# EAGLE design Rfid (EAGLE 7.6.0)
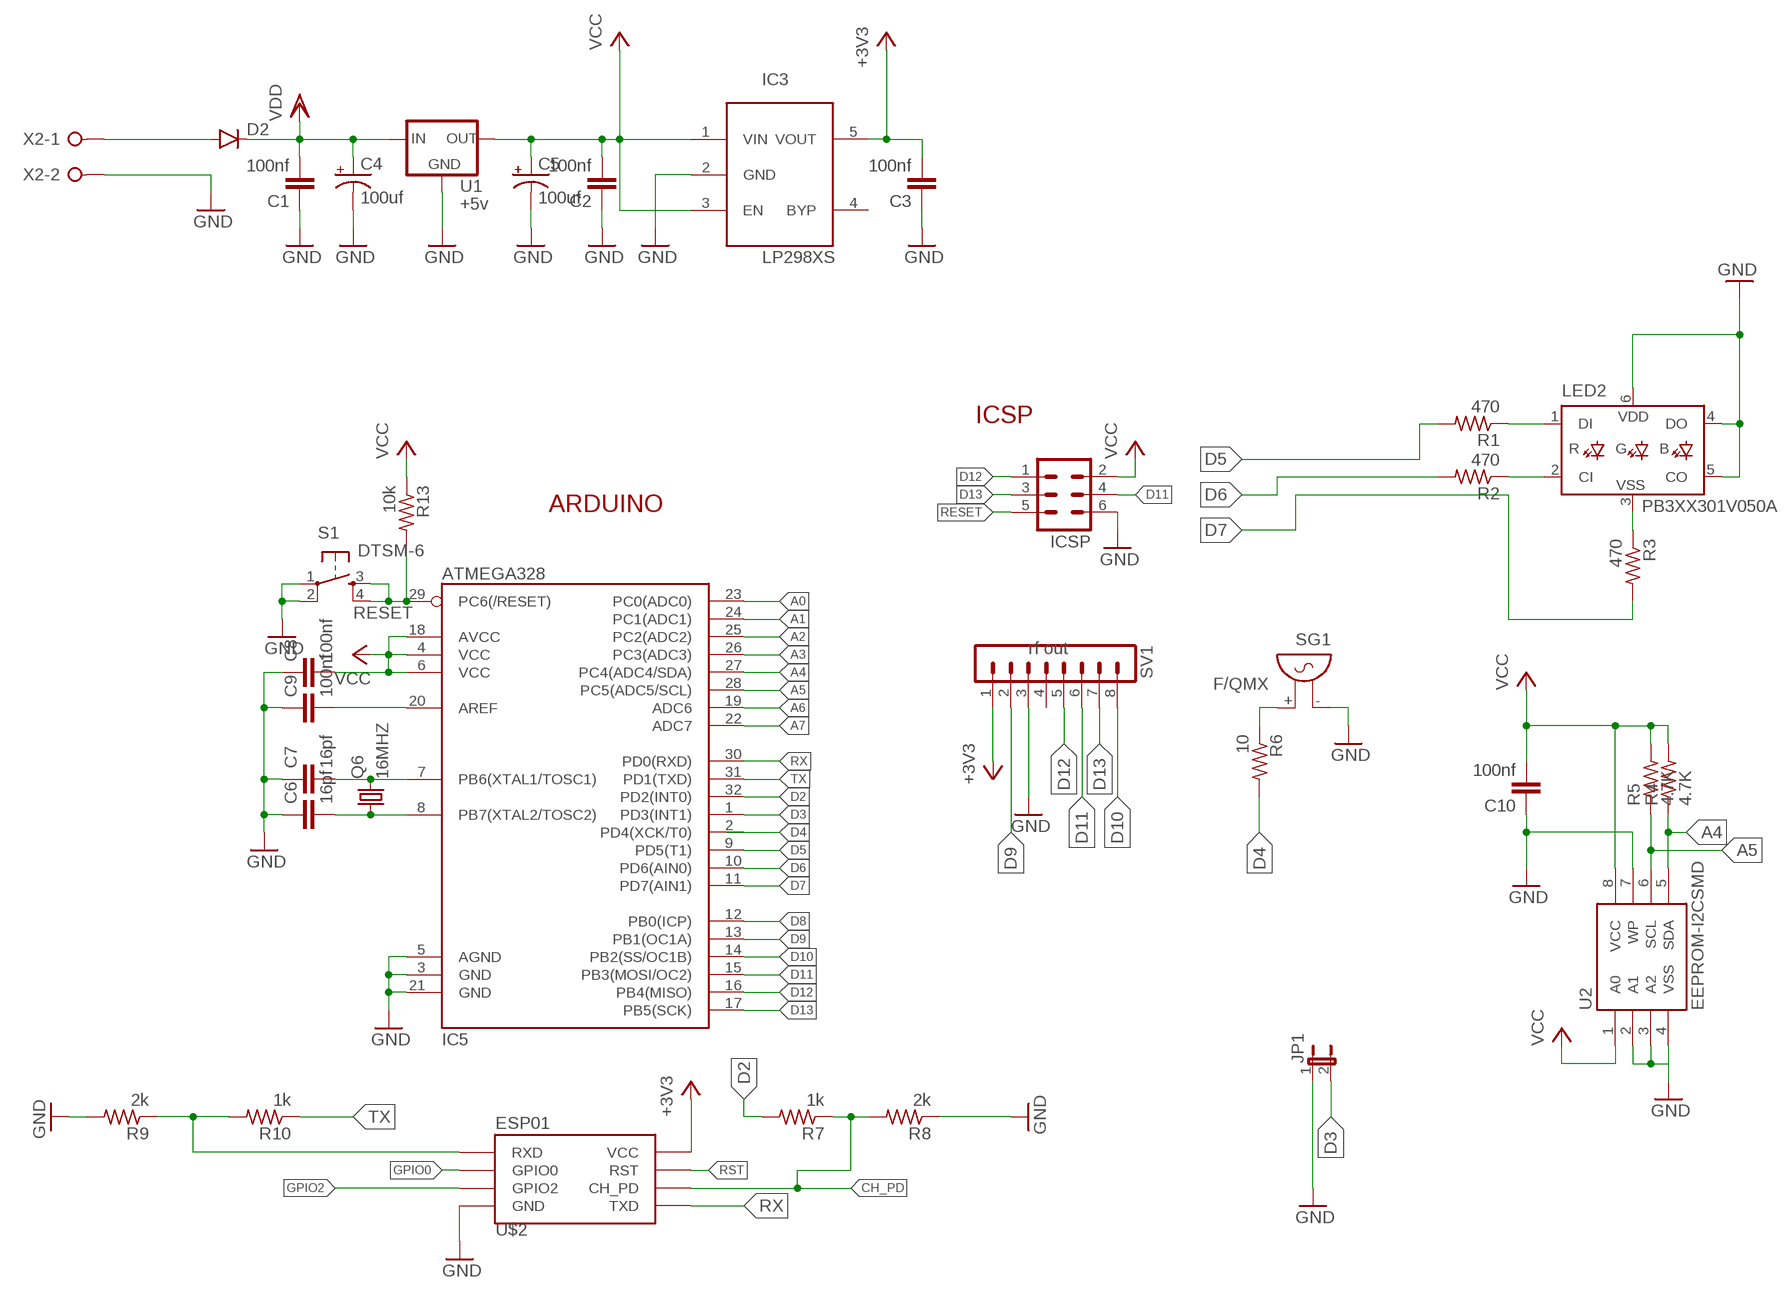
[diagram p0: schematic, sheet 1]

## Parts
C1  100nf  C-EUC0805  [C0805]
C2  100nf  C-EUC0805  [C0805]
C3  100nf  C-EUC0805  [C0805]
C4  100uf  CAP_POLD  [PANASONIC_D]
C5  100uf  CAP_POLD  [PANASONIC_D]
C6  16pf  C-EUC0805  [C0805]
C7  16pf  C-EUC0805  [C0805]
C8  100nf  C-EUC0805  [C0805]
C9  100nf  C-EUC0805  [C0805]
C10  100nf  C-EUC0805  [C0805]
D2  DIODESMA-ALT  [SMA-DIODE_ALT]
IC3  LP298XS  [SOT23-5L]
IC5  ATMEGA328  ATMEGA168  [TQFP32-08]
ICSP  ML6  [ML6]
JP1  JUMPER-2PTH  [1X02]
LED2  PB3XX301V050A  [PB3XX301V050A]
Q6  16MHZ  CRYSTALHC49S  [HC49/S]
R1  470  R-US_R0805  [R0805]
R2  470  R-US_R0805  [R0805]
R3  470  R-US_R0805  [R0805]
R4  4.7K  R-US_R0805  [R0805]
R5  4.7K  R-US_R0805  [R0805]
R6  10  R-US_R0805  [R0805]
R7  1k  R-US_R0805  [R0805]
R8  2k  R-US_R0805  [R0805]
R9  2k  R-US_R0805  [R0805]
R10  1k  R-US_R0805  [R0805]
R13  10k  R-US_R0805  [R0805]
S1  DTSM-6  [DTSM-6]
SG1  F/QMX  [F/QMX]
SV1  MA08-1  [MA08-1]
U1  +5v  V_REG_78XX7812  [TO-252]
U2  EEPROM-I2CSMD  [SO08]
U$2  ESP01  [ESP01]
X2  W237-02P  [W237-132]

## Nets
+3V3: C3.2 IC3.5(VOUT) SV1.1 U$2.VCC
A0: IC5.23(PC0(ADC0))
A1: IC5.24(PC1(ADC1))
A2: IC5.25(PC2(ADC2))
A3: IC5.26(PC3(ADC3))
A4: IC5.27(PC4(ADC4/SDA)) R4.1 U2.5(SDA)
A5: IC5.28(PC5(ADC5/SCL)) R5.1 U2.6(SCL)
A6: IC5.19(ADC6)
A7: IC5.22(ADC7)
CH_PD: R7.1 R8.2 U$2.CH_PD
D2: IC5.32(PD2(INT0)) R7.2
D3: IC5.1(PD3(INT1)) JP1.2
D4: IC5.2(PD4(XCK/T0)) R6.2
D5: IC5.9(PD5(T1)) R1.2
D6: IC5.10(PD6(AIN0)) R2.2
D7: IC5.11(PD7(AIN1)) R3.2
D8: IC5.12(PB0(ICP))
D9: IC5.13(PB1(OC1A)) SV1.2
D10: IC5.14(PB2(SS/OC1B)) SV1.8
D11: IC5.15(PB3(MOSI/OC2)) ICSP.4 SV1.6
D12: IC5.16(PB4(MISO)) ICSP.1 SV1.5
D13: IC5.17(PB5(SCK)) ICSP.3 SV1.7
GND: C1.1 C2.1 C3.1 C4.- C5.- C6.1 C7.1 C8.1 C9.1 C10.1 IC3.2(GND) IC5.3(GND) IC5.5(AGND) IC5.21(GND) ICSP.6 JP1.1 LED2.4(DO) LED2.5(CO) LED2.6(VDD) R8.1 R9.2 S1.1 S1.2 SG1.- SV1.3 U1.3(GND) U2.2(A1) U2.3(A2) U2.4(VSS) U2.7(WP) U$2.GND X2.2
GPIO0: U$2.GPIO0
GPIO2: U$2.GPIO2
N$1: R9.1 R10.2 U$2.RX(RXD)
N$5: D2.A X2.1
N$6: LED2.1(DI) R1.1
N$7: LED2.2(CI) R2.1
N$8: LED2.3(VSS) R3.1
N$9: R6.1 SG1.+
N$34: C7.2 IC5.7(PB6(XTAL1/TOSC1)) Q6.2
N$35: C6.2 IC5.8(PB7(XTAL2/TOSC2)) Q6.1
N$36: C9.2 IC5.20(AREF)
RESET: IC5.29(PC6(/RESET)) ICSP.5 R13.2 S1.3 S1.4
RST: U$2.RST
RX: IC5.30(PD0(RXD)) U$2.TX(TXD)
TX: IC5.31(PD1(TXD)) R10.1
VCC: C2.2 C5.+ C8.2 C10.2 IC3.1(VIN) IC3.3(EN) IC5.4(VCC) IC5.6(VCC) IC5.18(AVCC) ICSP.2 R4.2 R5.2 R13.1 U1.2(OUT) U2.1(A0) U2.8(VCC)
VDD: C1.2 C4.+ D2.C U1.1(IN)
Unconnected: IC3.4(BYP) SV1.4

## Notes on the sheet
- ICSP
- ARDUINO
- rf out

## Library data of the parts
C1-C3 C6-C10 = resistor:C-EU: CAPACITOR, European symbol
C4 C5 = SparkFun-Capacitors:CAP_POL: Capacitor Polarized These are standard SMD and PTH capacitors. Normally 10uF, 47uF, and 100uF in electrolytic and tantalum varieties. Always verify the external diameter of the through hole cap, it varies with capacity, voltage, and manufacturer. The EIA devices should be standard.
D2 = SparkFun-DiscreteSemi:DIODE: Diode These are standard reverse protection diodes and small signal diodes. SMA package can handle up to about 1A. SOD-323 can handle about 200mA. What the SOD-323 package when ordering, there are some mfgs out there that are 5-pin packages.
IC3 = adafruit:LP298X
IC5 = SparkFun:ATMEGA168
ICSP = con-harting-ml:ML6: HARTING
JP1 = SparkFun-Retired:JUMPER-2: Jumper Basic 0.1" spaced jumper. Use with breakaway headers.
LED2 = led:PB3XX301V050A: Self-addressed led , single point control with integrated RGB leds and drive IC Easy control by MCU. Source: DycolED.pdf Data sheet <http://www.kirronlightcomponents.com/index.php/download_file/view/41/83/>
Q6 = crystal:CRYSTAL: CRYSTAL
R1-R10 R13 = resistor:R-US_: RESISTOR, American symbol
S1 = switch-tact:DTSM-6
SG1 = buzzer:F/QMX: BUZZER Source: Buerklin; OC_FARNELL: unknown; OC_NEWARK: unknown
SV1 = con-lstb:MA08-1: PIN HEADER; OC_FARNELL: unknown; OC_NEWARK: unknown
U1 = SparkFun-PowerIC:V_REG_78XX: Voltage Regulator Standard 78xx regulator. IGO (Input Ground Output). Spark Fun Electronics SKU : COM-00107; PROD_ID: VREG-12370; VALUE: +12v
U2 = SparkFun-DigitalIC:EEPROM-I2C: I2C EEPROM chips, 24LC256 (and others)
U$2 = esp8266modules:ESP01: ESP8266 Wifi module 01
X2 = con-wago-508:W237-02P: WAGO SREW CLAMP; OC_FARNELL: unknown; OC_NEWARK: unknown

## Net classes
0 default: width 0.152 mm, drill 0.305 mm, clearance 0.152 mm
1 vcc: width 0.305 mm
2 motors: width 1.016 mm

## Board
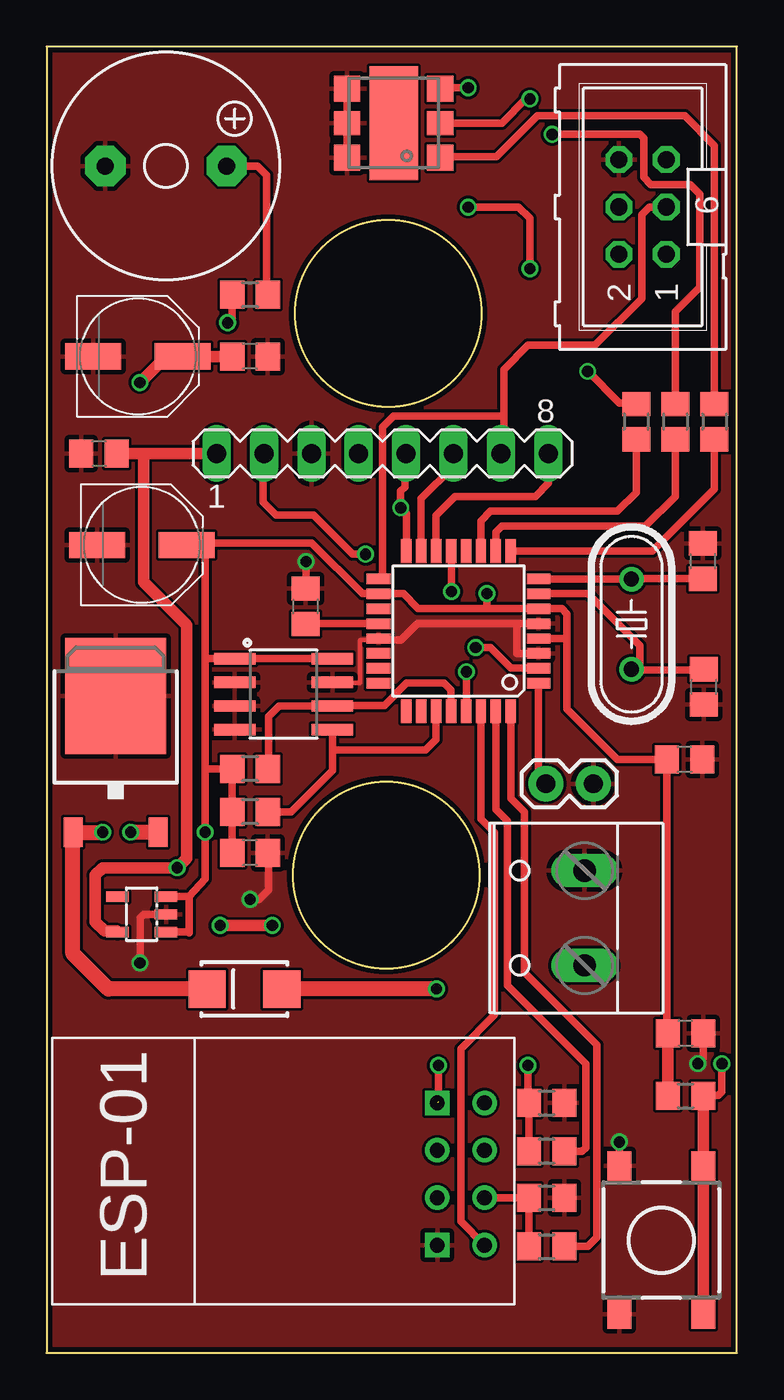
[diagram p1: board, top side]
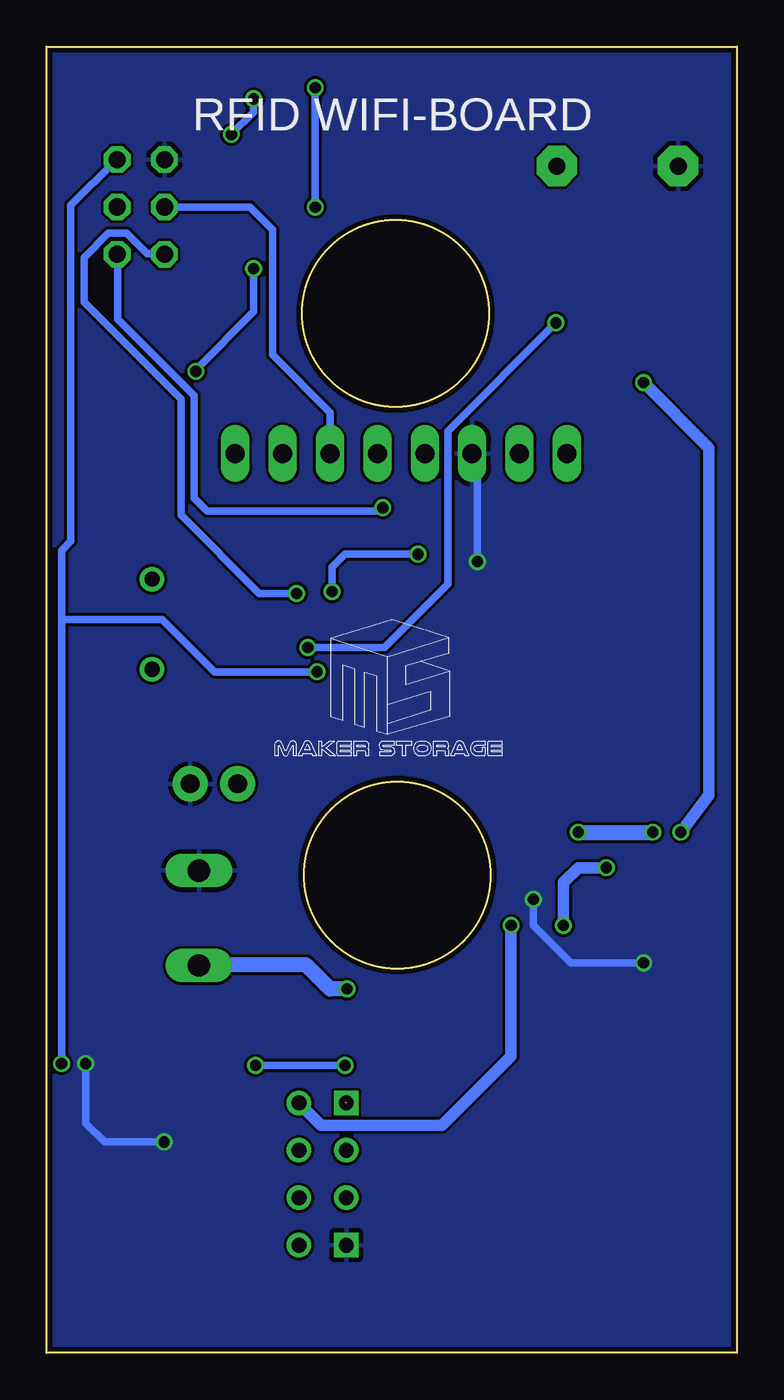
[diagram p2: board, bottom side, seen from below]

Size 37 x 70 mm. Coordinates in mm from the lower left corner, seen from the top.
Outline: 0,0 37,0 37,70 0,70 0,0
Outline: circle at 18.3,55.7 radius 5
Outline: circle at 18.2,25.6 radius 5
Copper layers (1*16): Top 0.035mm / dielectric 1.5mm / Bottom 0.035mm
Design rules "SeeedStudio_2layer_DRU_no_angle_20140221": minimum track width 6mil, minimum drill 12mil, track to track 6mil, track to pad 6mil, pad to pad 6mil, via to via 6mil, smd to smd 0mil, copper to edge 10mil, drill to drill 10mil, minimum pad ring 10mil, minimum via ring 6mil, stop-mask expansion 2mil, vias tented up to drill 100mil, thermal gap 10mil

### Footprints (pad centres in the part's own frame; a part is rotated, then mirrored left to right if it is on the bottom)
C0805 = smd 1.3 x 1.5: 1 -0.95,0; 2 0.95,0
PANASONIC_D = smd 3 x 1.4: + 2.4,0; - -2.4,0
SMA-DIODE_ALT = smd 2 x 2: A -2,0; C 2,0
SOT23-5L = smd 0.55 x 1.2: 1 -0.95,-1.3; 2 0,-1.3; 3 0.95,-1.3; 4 0.95,1.3; 5 -0.95,1.3
TQFP32-08 = smd 1.27 x 0.559: 1 -4.293,2.8; 2 -4.293,2; 3 -4.293,1.2; 4 -4.293,0.4; 5 -4.293,-0.4; 6 -4.293,-1.2; 7 -4.293,-2; 8 -4.293,-2.8; 17 4.293,-2.8; 18 4.293,-2; 19 4.293,-1.2; 20 4.293,-0.4; 21 4.293,0.4; 22 4.293,1.2; 23 4.293,2; 24 4.293,2.8 | smd 0.559 x 1.27: 9 -2.8,-4.293; 10 -2,-4.293; 11 -1.2,-4.293; 12 -0.4,-4.293; 13 0.4,-4.293; 14 1.2,-4.293; 15 2,-4.293; 16 2.8,-4.293; 25 2.8,4.293; 26 2,4.293; 27 1.2,4.293; 28 0.4,4.293; 29 -0.4,4.293; 30 -1.2,4.293; 31 -2,4.293; 32 -2.8,4.293
ML6 = drill 0.914 octagon: 1 -2.54,-1.27; 2 -2.54,1.27; 3 0,-1.27; 4 0,1.27; 5 2.54,-1.27; 6 2.54,1.27
1X02 = drill 1.016 pad 1.88: 1 0,0; 2 2.54,0
PB3XX301V050A = smd 1.4 x 1.4: 1 -1.85,-2.5; 3 1.85,-2.5; 4 -1.85,2.5; 6 1.85,2.5 | smd 1.3 x 1.4: 2 0,-2.5; 5 0,2.5 | smd 6.1 x 2.6: HT 0,0
HC49/S = drill 0.813: 1 -2.413,0; 2 2.413,0
R0805 = smd 1.3 x 1.5: 1 -0.95,0; 2 0.95,0
DTSM-6 = smd 1.55 x 1.3: 1 -3.975,2.25; 2 3.975,2.25; 3 -3.975,-2.25; 4 3.975,-2.25
F/QMX = drill 0.914 pad 2.159 octagon: + 3.251,0; - -3.251,0
MA08-1 = drill 1.016 long: 1 -8.89,0; 2 -6.35,0; 3 -3.81,0; 4 -1.27,0; 5 1.27,0; 6 3.81,0; 7 6.35,0; 8 8.89,0
TO-252 = smd 1 x 1.6: 1 -2.28,-4.8; 2 2.28,-4.8 | smd 5.4 x 6.2: 3 0,2.5
SO08 = smd 0.61 x 2.21: 1 -1.905,-2.616; 2 -0.635,-2.616; 3 0.635,-2.616; 4 1.905,-2.616; 5 1.905,2.616; 6 0.635,2.616; 7 -0.635,2.616; 8 -1.905,2.616
ESP01 = drill 0.8: CH_PD -1.285,-8.178; GPIO0 1.255,-5.638; GPIO2 -1.285,-5.638; RST 1.255,-8.178; TX -3.825,-8.178; VCC 3.795,-8.178 | drill 0.8 square: GND -3.825,-5.638; RX 3.795,-5.638
W237-132 = drill 1.194 long: 1 -2.54,-0.635; 2 2.54,-0.635

### Placement (x,y rotation side)
C1  10.9,53.4 180 top
C2  34.2,31.8 180 top
C3  2.8,48.2 0 top
C4  4.9,53.4 0 top
C5  5.1,43.3 0 top
C6  35.17,42.43 270 top
C7  35.23,35.69 90 top
C8  34.25,17.12 180 top
C9  13.87,40.01 270 top
C10  10.9,26.8 180 top
D2  10.6,19.5 180 top
IC3  5.1,23.5 90 top
IC5  22.08,38.68 180 top
ICSP  31.95,61.41 90 top
JP1  29.3,30.5 180 top
LED2  18.6,65.9 90 top
Q6  31.35,39.05 270 top
R1  35.8,49.9 270 top
R2  33.7,49.9 270 top
R3  31.6,49.9 270 top
R4  10.9,29 180 top
R5  10.9,31.3 180 top
R6  10.9,56.7 180 top
R7  26.8,5.7 0 top
R8  26.8,8.3 180 top
R9  26.8,13.4 0 top
R10  26.8,10.8 180 top
R13  34.25,13.77 0 top
S1  32.95,6.04 90 top
SG1  6.4,63.6 0 top
SV1  18,48.2 0 top
U1  3.7,32.7 0 top
U2  12.7,35.3 270 top
U$2  15.3,9.6 90 top
X2  28.2,23.3 90 top

### Tracks (layer width: path | path; a pad name or v marks a point on that pad's centre or on a via)
+3V3  (via drill 0.6)
  Top 0.61: SV1.1 5.1,48.2 | 5.1,48.2 C3.2 | IC3.5 3.75,22.6 3.1,22.6 2.6,23.1 2.6,25.6 3,26 v7,26 7.5,26.5 7.5,39 5.2,41.3 5.2,48.1 5.1,48.2 | v9.3,22.9 v12.1,22.9
  Bottom 0.61: U$2.VCC 23.4,13.3 22.3,12.2 15.8,12.2 12.1,15.9 v12.1,22.9 | v7,26 8.5,26 9.3,25.2 v9.3,22.9
A4
  Top 0.406: U2.5 15.32,32.3 | 15.32,32.3 15.32,31.22 13.1,29 R4.1 | IC5.27 20.88,32.88 20.3,32.3 15.32,32.3
A5
  Top 0.406: R5.1 11.9,31.35 11.9,34.1 12.46,34.66 U2.6 15.35,34.7 18.1,34.7 19.3,35.9 21.3,35.9 21.68,35.52 IC5.28
CH_PD
  Top 0.406: R7.1 R8.2 U$2.CH_PD
D2
  Top 0.406: R7.2 29,5.7 29.45,6.15 29.5,6.2 29.5,16.5 25.6,20.4 25.6,29 24.88,29.72 IC5.32
D3
  Top 0.406: IC5.1 26.37,30.89 JP1.2
D4  (via drill 0.6)
  Top 0.406: IC5.2 26.3,36.7 24.9,36.7 23.8,37.8 v23,37.8 | v9.7,55.2 9.95,55.2 R6.2
  Bottom 0.406: v9.7,55.2 15.5,49.4 15.5,41.2 18.9,37.8 v23,37.8
D5
  Top 0.406: IC5.9 32.47,42.97 35.8,46.3 R1.2
D6
  Top 0.406: IC5.10 24.08,43.98 24.4,44.3 32.1,44.3 33.7,45.9 R2.2
D7
  Top 0.406: IC5.11 23.28,44.58 23.8,45.1 30.6,45.1 31.6,46.1 R3.2
D9  (via drill 0.6)
  Top 0.406: 11.7,48.2 SV1.2 11.6,48.15 11.6,45.6 12.3,44.9 14.3,44.9 16.4,42.8 v17.1,42.8 | IC5.13 21.7,42.9 v21.7,40.8
  Bottom 0.406: v17.1,42.8 21,42.8 21.7,42.1 v21.7,40.8
D10
  Top 0.406: IC5.14 20.88,44.88 21.9,45.9 26.2,45.9 26.9,46.6 26.9,48.49 SV1.8
D11
  Top 0.406: IC5.15 20.08,45.78 21.8,47.5 SV1.6
  Bottom 0.406: ICSP.4 26.1,61.4 24.9,60.2 24.9,53.5 21.8,50.4 SV1.6
D12  (via drill 0.6)
  Top 0.406: IC5.16 19.28,44.99 v18.98,45.29 18.98,46.18 19.2,46.4 19.2,48.13 SV1.5
  Bottom 0.406: ICSP.1 33.2,58.85 33.2,55.4 29.1,51.3 29.1,45.8 28.4,45.1 19.17,45.1 v18.98,45.29
D13
  Top 0.406: IC5.17 18,41.6 18,49.6 18.6,50.2 24.5,50.2 | SV1.7 24.5,48.35 24.5,50.2 | ICSP.3 32.3,61.4 31.9,61 31.9,56.5 29.4,54 25.8,54 24.5,52.7 24.5,50.2
GND  (via drill 0.6)
  Top 0.254: U2.7 15.4,35.9 16.8,35.9 16.8,38.2 17.71,38.2 IC5.21 | 10.1,33.5 U2.4
  Top 0.406: v30.7,11.3 S1.2 | v34.9,15.5 35.2,15.8 C8.1 | IC5.21 17.87,38.2 19,38.2 19.88,39.08 25.2,39.08 | v13.9,42.4 13.9,41 C9.1 | C10.1 11.9,26.8 11.9,24.8 11.4,24.3 v10.9,24.3 | IC3.2 5.2,23.5 5,23.3 v5,20.9 | IC5.5 25.2,39.08 | IC5.3 25.2,37.48 25.2,39.08 | LED2.4 LED2.5 LED2.6
  Bottom 0.406: v13.9,42.4 13.9,48 14.1,48.2 SV1.3 | v5,20.9 8.9,20.9 10.9,22.9 v10.9,24.3 | v30.7,11.3 33.9,11.3 34.9,12.3 v34.9,15.5
  pour Top: 0,70 37,70 37,0 0,0
  pour Bottom: 0,70 37,70 37,0 0,0
N$1  (via drill 0.6)  (1 unrouted)
  Top 0.406: R10.2 R9.1 25.8,13.45 v25.8,15.4 | 21,13.46 v21,15.4
  Bottom 0.406: v25.8,15.4 v21,15.4
N$5  (via drill 0.6)
  Top 0.813: v20.9,19.5 D2.A
  Bottom 0.813: v20.9,19.5 21.8,19.5 23.1,20.8 28.8,20.8 X2.1
N$6
  Top 0.406: R1.1 35.8,64.7 34.2,66.3 26.3,66.3 24.1,64.1 21.15,64.1 LED2.1
N$7  (via drill 0.6)
  Top 0.406: R2.1 33.7,55.8 35,57.1 35,62.1 34.5,62.6 32.4,62.6 32,63 32,65.1 31.8,65.3 v27.1,65.3 | 25.9,67.3 v25.9,67.2 25.7,67.2 24.4,65.9 LED2.2
  Bottom 0.406: v25.9,67.2 25.9,66.5 v27.1,65.3
N$8  (via drill 0.6)
  Top 0.406: v22.6,67.8 21.1,67.8 LED2.3 | v29,52.6 30.7,50.9 31.6,50.9 R3.1 | v25.9,58.1 25.9,60.8 25.3,61.4 v22.6,61.4
  Bottom 0.406: v22.6,61.4 v22.6,67.8 | v29,52.6 29,52.7 25.9,55.8 v25.9,58.1
N$9
  Top 0.406: R6.1 11.8,56.7 11.8,63.1 11.3,63.6 SG1.+
N$34
  Top 0.406: IC5.7 29.02,40.68 31.8,37.9 31.8,36.69 Q6.2 32,36.6 35.7,36.6 C7.2
N$35
  Top 0.406: IC5.8 31.73,41.48 Q6.1 31.9,41.5 35.6,41.5 C6.2
N$36
  Top 0.406: IC5.20 13.89,39.08 C9.2
RESET  (via drill 0.6)
  Top 0.406: IC5.29 22.5,34.5 v22.5,36.5 | v36.2,15.5 36.2,14 36,13.8 35.23,13.8 R13.2
  Top 0.61: S1.3 S1.4 R13.2
  Bottom 0.406: ICSP.5 33.3,63.9 35.7,61.5 35.7,43.5 36.2,43 36.2,39.2 | v22.5,36.5 28,36.5 30.8,39.3 36.1,39.3 36.2,39.2 | v36.2,15.5 36.2,39.2
RX
  Top 0.406: IC5.30 23.28,28.62 24,27.9 24,18.1 22.2,16.3 22.2,7.05 U$2.TX
TX
  Top 0.406: IC5.31 24.08,29.12 24.7,28.5 24.7,19.7 28.9,15.5 28.9,11 28.7,10.8 R10.1
VCC  (via drill 0.6)
  Top 0.406: 6.35,24.5 IC3.3 | IC5.4 27.88,38.28 | 27.88,38.28 27.9,38.3 27.9,39.6 27.62,39.88 IC5.6 26.35,39.9 23.6,39.9 | 8.5,43.4 14.2,43.4 16.92,40.68 IC5.18 19.12,40.68 19.9,39.9 23.6,39.9 | 6.6,24.5 IC3.3 | 6,27.9 U1.2 | IC3.3 7.65,24.45 | 7.65,24.45 8.5,25.4 v8.5,27.9 8.5,31.2 | C5.+ 8.5,43.4 | 8.5,43.4 8.5,37.2 | 8.5,37.2 8.5,31.2 | 8.5,37.2 8.51,37.2 U2.1 U2.8 | 8.5,31.2 8.6,31.3 R5.2 R4.2 C10.2 | 7.65,24.45 7.65,22.5 7.6,22.55 IC3.1 | 23.6,39.9 v23.6,40.7 | 27.88,38.28 27.9,38.26 27.9,34.5 30.6,31.8 C2.2 33.25,16.65 33.3,16.6
  Top 0.61: R13.1 33.3,16.6 C8.2
  Top 0.813: 6,27.9 v4.5,27.9
  Bottom 0.406: ICSP.2 30.7,58.9 31.6,58.9 32.7,60 33.7,60 35,58.7 35,56.3 29.8,51.1 29.8,44.9 25.6,40.7 v23.6,40.7
  Bottom 0.813: v8.5,27.9 v4.5,27.9
VDD  (via drill 0.6)
  Top 0.61: C1.2 C4.+ | 6.7,53.4 C4.+ | v5,52 6.5,53.5 C4.+ | 1.5,27.9 U1.1
  Top 0.813: 1.5,27.9 v3,27.9 | D2.C 3.3,19.5 1.4,21.4 1.4,27.88 U1.1
  Bottom 0.61: v5,52 1.5,48.5 1.5,29.9 v3,27.9

### Text on the board
bPlace: RFID WIFI-BOARD